# Altium schematic sheet imx477_sensor.SchDoc
size A3
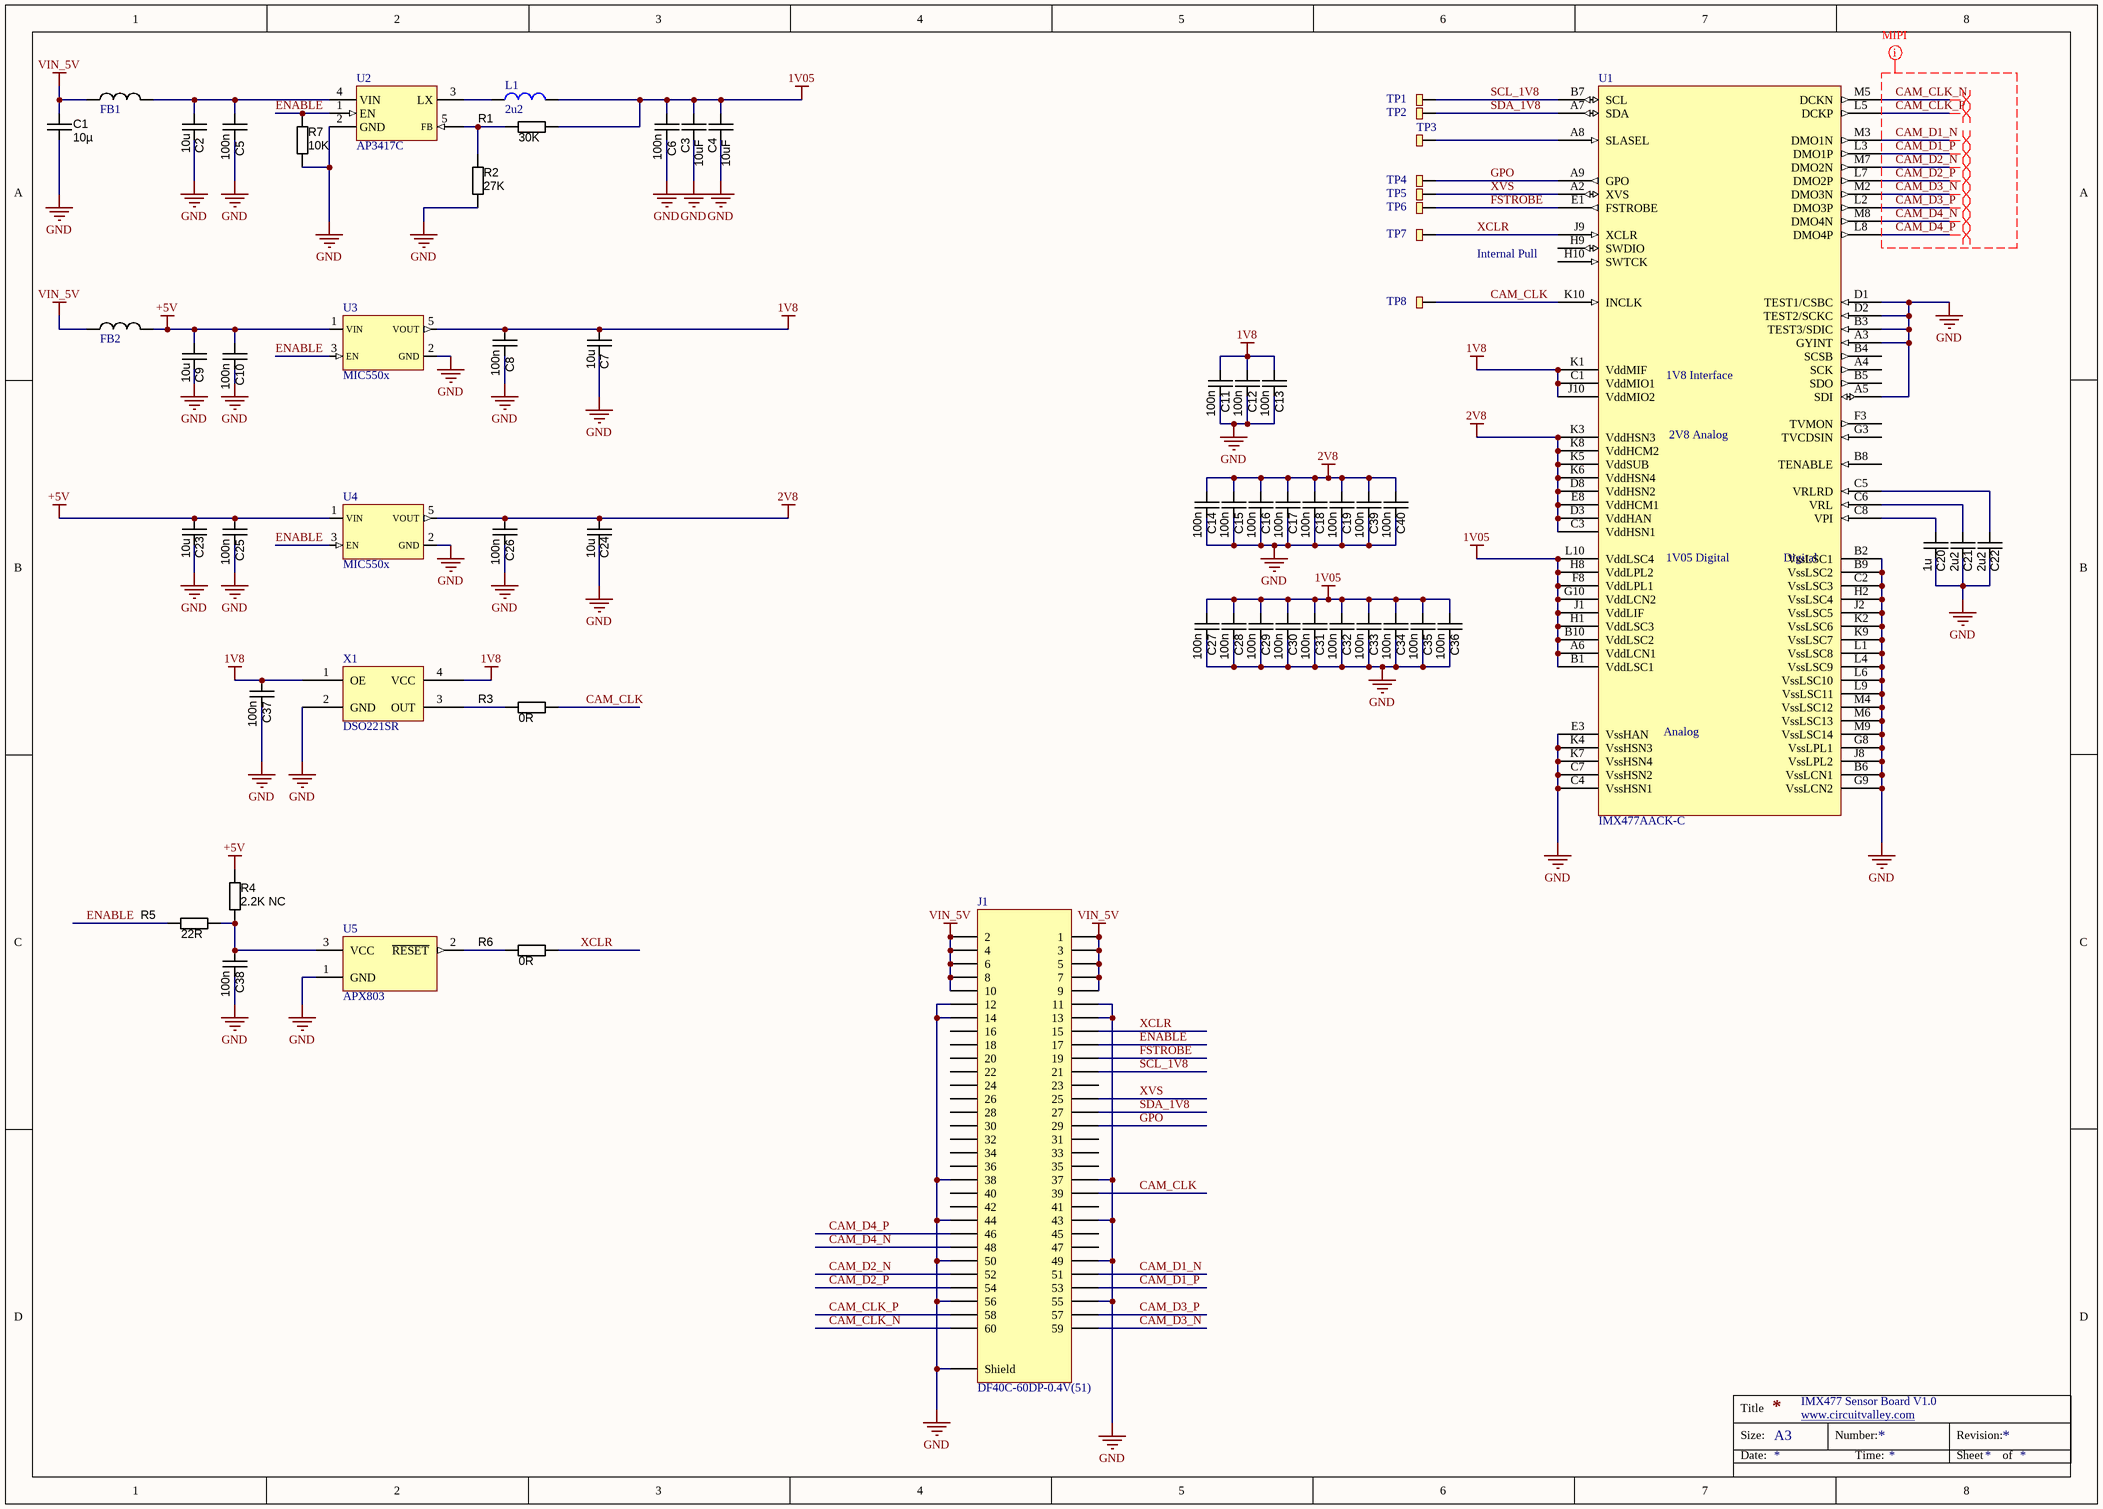
[diagram p0: imx477_sensor.SchDoc]

## Parts
C1  10µ  [CAPC3225N]
C2  value 10u  [CAPC1608N]  (hidden comment: approved sub OK)
C3  10uF  [CAPC2012N]
C4  10uF  [CAPC2012N]
C5  100n  [CAPC1005N]
C6  100n  [CAPC1005N]
C7  value 10u  [CAPC1608N]  (hidden comment: approved sub OK)
C8  100n  [CAPC1005N]
C9  value 10u  [CAPC1608N]  (hidden comment: approved sub OK)
C10  100n  [CAPC1005N]
C11  100n  [CAPC1005N]
C12  100n  [CAPC1005N]
C13  100n  [CAPC1005N]
C14  100n  [CAPC1005N]
C15  100n  [CAPC1005N]
C16  100n  [CAPC1005N]
C17  100n  [CAPC1005N]
C18  100n  [CAPC1005N]
C19  100n  [CAPC1005N]
C20  value 1u  [CAPC1608N]  (hidden comment: approved sub OK)
C21  value 2u2  [CAPC1608N]  (hidden comment: approved sub OK)
C22  value 2u2  [CAPC1608N]  (hidden comment: approved sub OK)
C23  value 10u  [CAPC1608N]  (hidden comment: approved sub OK)
C24  value 10u  [CAPC1608N]  (hidden comment: approved sub OK)
C25  100n  [CAPC1005N]
C26  100n  [CAPC1005N]
C27  100n  [CAPC1005N]
C28  100n  [CAPC1005N]
C29  100n  [CAPC1005N]
C30  100n  [CAPC1005N]
C31  100n  [CAPC1005N]
C32  100n  [CAPC1005N]
C33  100n  [CAPC1005N]
C34  100n  [CAPC1005N]
C35  100n  [CAPC1005N]
C36  100n  [CAPC1005N]
C37  100n  [CAPC1005N]
C38  100n  [CAPC1005N]
C39  100n  [CAPC1005N]
C40  100n  [CAPC1005N]
FB1  Ferrite  [INDC1608N]  (value not drawn)
FB2  Ferrite  [INDC1608N]  (value not drawn)
J1  DF40C-60DP-0.4V(51)  [DF40C-60DP-0.4V]
L1  2u2  [FDSD0420-H-2R2M]
R1  value 30K  [RESC1005N]  (hidden comment: Thick Film)
R2  value 27K  [RESC1005N]  (hidden comment: Thick Film)
R3  value 0R  [RESC1005N]  (hidden comment: Thick Film)
R4  value 2.2K NC  [RESC1005N]  (hidden comment: Thick Film)
R5  value 22R  [RESC1005N]  (hidden comment: Thick Film)
R6  value 0R  [RESC1005N]  (hidden comment: Thick Film)
R7  value 10K  [RESC1005N]  (hidden comment: Thick Film)
TP1  TestPoint  [SMD_test_point]  (value not drawn)
TP2  TestPoint  [SMD_test_point]  (value not drawn)
TP3  TestPoint  [SMD_test_point]  (value not drawn)
TP4  TestPoint  [SMD_test_point]  (value not drawn)
TP5  TestPoint  [SMD_test_point]  (value not drawn)
TP6  TestPoint  [SMD_test_point]  (value not drawn)
TP7  TestPoint  [SMD_test_point]  (value not drawn)
TP8  TestPoint  [SMD_test_point]  (value not drawn)
U1  IMX477AACK-C  [IMX477]
U2  AP3417C  [SOT23-5]
U3  MIC550x  [SOT23-5]
U4  MIC550x  [SOT23-5]
U5  APX803  [SOT23-3]
X1  DSO221SR  [Active Oscillator 2520]

## Nets
1V05: C3.1 C4.1 C6.2 C27.2 C28.2 C29.2 C30.2 C31.2 C32.2 C33.2 C34.2 C35.2 C36.2 L1.2 R1.2 U1.A6(VddLCN1) U1.B1(VddLSC1) U1.B10(VddLSC2) U1.F8(VddLPL1) U1.G10(VddLCN2) U1.H1(VddLSC3) U1.H8(VddLPL2) U1.J1(VddLIF) U1.L10(VddLSC4)
1V8: C7.1 C8.2 C11.2 C12.2 C13.2 C37.2 U1.C1(VddMIO1) U1.J10(VddMIO2) U1.K1(VddMIF) U3.5(VOUT) X1.1(OE) X1.4(VCC)
2V8: C14.2 C15.2 C16.2 C17.2 C18.2 C19.2 C24.1 C26.2 C39.2 C40.2 U1.C3(VddHSN1) U1.D3(VddHAN) U1.D8(VddHSN2) U1.E8(VddHCM1) U1.K3(VddHSN3) U1.K5(VddSUB) U1.K6(VddHSN4) U1.K8(VddHCM2) U4.5(VOUT)
+5V: C9.1 C10.2 C23.1 C25.2 FB2.2 R4.2 U3.1(VIN) U4.1(VIN)
GND: C1.2 C2.2 C3.2 C4.2 C5.1 C6.1 C7.2 C8.1 C9.2 C10.1 C11.1 C12.1 C13.1 C14.1 C15.1 C16.1 C17.1 C18.1 C19.1 C20.2 C21.2 C22.2 C23.2 C24.2 C25.1 C26.1 C27.1 C28.1 C29.1 C30.1 C31.1 C32.1 C33.1 C34.1 C35.1 C36.1 C37.1 C38.1 C39.1 C40.1 J1.11 J1.12 J1.13 J1.14 J1.37 J1.38 J1.43 J1.44 J1.49 J1.50 J1.55 J1.56 J1.S1(Shield) R2.1 R7.1 U1.A3(GYINT) U1.A5(SDI) U1.B2(VssLSC1) U1.B3(TEST3/SDIC) U1.B6(VssLCN1) U1.B9(VssLSC2) U1.C2(VssLSC3) U1.C4(VssHSN1) U1.C7(VssHSN2) U1.D1(TEST1/CSBC) U1.D2(TEST2/SCKC) U1.E3(VssHAN) U1.G8(VssLPL1) U1.G9(VssLCN2) U1.H2(VssLSC4) U1.J2(VssLSC5) U1.J8(VssLPL2) U1.K2(VssLSC6) U1.K4(VssHSN3) U1.K7(VssHSN4) U1.K9(VssLSC7) U1.L1(VssLSC8) U1.L4(VssLSC9) U1.L6(VssLSC10) U1.L9(VssLSC11) U1.M4(VssLSC12) U1.M6(VssLSC13) U1.M9(VssLSC14) U2.2(GND) U3.2(GND) U4.2(GND) U5.1(GND) X1.2(GND)
VIN_5V: C1.1 FB1.1 FB2.1 J1.1 J1.2 J1.3 J1.4 J1.5 J1.6 J1.7 J1.8 J1.9 J1.10
CAM_CLK: J1.39 R3.2 TP8.1(TP) U1.K10(INCLK)
CAM_CLK_N: J1.60 U1.M5(DCKN)
CAM_CLK_P: J1.58 U1.L5(DCKP)
CAM_D1_N: J1.51 U1.M3(DMO1N)
CAM_D1_P: J1.53 U1.L3(DMO1P)
CAM_D2_N: J1.52 U1.M7(DMO2N)
CAM_D2_P: J1.54 U1.L7(DMO2P)
CAM_D3_N: J1.59 U1.M2(DMO3N)
CAM_D3_P: J1.57 U1.L2(DMO3P)
CAM_D4_N: J1.48 U1.M8(DMO4N)
CAM_D4_P: J1.46 U1.L8(DMO4P)
ENABLE: J1.17 R5.1 R7.2 U2.1(EN) U3.3(EN) U4.3(EN)
FSTROBE: J1.19 TP6.1(TP) U1.E1(FSTROBE)
GPO: J1.29 TP4.1(TP) U1.A9(GPO)
SCL_1V8: J1.21 TP1.1(TP) U1.B7(SCL)
SDA_1V8: J1.27 TP2.1(TP) U1.A7(SDA)
XCLR: J1.15 R6.2 TP7.1(TP) U1.J9(XCLR)
XVS: J1.25 TP5.1(TP) U1.A2(XVS)
NetC2_1: C2.1 C5.2 FB1.2 U2.4(VIN)
NetC20_1: C20.1 U1.C8(VPI)
NetC21_1: C21.1 U1.C6(VRL)
NetC22_1: C22.1 U1.C5(VRLRD)
NetC38_2: C38.2 R4.1 R5.2 U5.3(VCC)
NetL1_1: L1.1 U2.3(LX)
NetR1_1: R1.1 R2.2 U2.5(FB)
NetR3_1: R3.1 X1.3(OUT)
NetR6_1: R6.1 U5.2(~{RESET})
NetTP3_1: TP3.1(TP) U1.A8(SLASEL)

Not connected (* = marked no-connect by the designer): J1 16 18 20 22 23 24 26 28 30 31 32 33 34 35 36 40 41 42 45 47; U1 A4(SCK) B4(SCSB) B5(SDO) B8(TENABLE) F3(TVMON) G3(TVCDSIN) H9(SWDIO) H10(SWTCK)

## Layout directives
net class MIPI: CAM_CLK_N, CAM_CLK_P, CAM_D1_N, CAM_D1_P, CAM_D2_N, CAM_D2_P, CAM_D3_N, CAM_D3_P, CAM_D4_N, CAM_D4_P
differential pair: CAM_CLK_N, CAM_CLK_P, CAM_D1_N, CAM_D1_P, CAM_D2_N, CAM_D2_P, CAM_D3_N, CAM_D3_P, CAM_D4_N, CAM_D4_P

## Notes on the sheet
- Internal Pull
- IMX477 Sensor Board V1.0
- www.circuitvalley.com <http://www.circuitvalley.com>
- Title
- Size:
- Date:
- A3
- Number:
- Time:
- Revision:
- Sheet
- of
- (in symbol IMX477AACK-C) 1V8 Interface; 2V8 Analog; 1V05 Digital; Digital; Analog

## Library data of the parts
C1 = CAPC_10u_1210_50V: Capacitor SMD Cer 10uF 20% 16V X5R 1210; Manufacturer 1: Taiyo Yuden; Manufacturer Part Number 1: UMK325BJ106MM-T; Ratings: 50V; X5R; Material: ceramic; Package / Case: 1210 (3225 Metric); Tolerance: ±20%; Size / Dimension: 0.126" L x 0.098" W (3.20mm x 2.50mm); Supplier 1: Digi-Key; Supplier Part Number 1: 587-2225-1-ND; Value: 10µ
C2 C7 C9 C20-C24 = CAPC_560p_0603_5%: Capacitor SMD Cer 560pF 5% 50V NP0 0603; Manufacturer 1: AVX Corporation; Manufacturer Part Number 1: 06035A561JAT2A; Ratings: 50V; NP0; Material: ceramic; Capacitance: 470pF; Package / Case: 0603 (1608 metric); Voltage - Rated: 50V; Mounting Type: Surface Mount, MLCC; Operating Temperature: -55°C ~ 125°C; Applications: General Purpose; Size / Dimension: 0.063" L x 0.032" W (1.60mm x 0.81mm); Height - Seated (Max): -; Thickness (Max): 0.035" (0.90mm); Lead Spacing: -; Lead Style: -; ComponentLink1URL: http://www.avx.com/docs/Catalogs/ccog.pdf; ComponentLink1Description: http://www.avx.com/docs/Catalogs/ccog.pdf; Supplier 1: Digi-Key; Supplier Part Number 1: 478-1184-1-ND
C3 C4 = CAPC_4u7_0805: Capacitor SMD Cer 4.7uF 10% 16V X5R 0805; Manufacturer 1: Taiyo Yuden; Manufacturer Part Number 1: EMK212BJ475KG-T; Ratings: 16V; X5R; Material: ceramic; Package / Case: 0805 (2012 Metric); Tolerance: ±10%; Supplier 1: Digi-Key; Supplier Part Number 1: 587-1294-1-ND; Operating Temperature: -55°C ~ 85°C; Size / Dimension: 0.079" L x 0.049" W (2.00mm x 1.25mm); Thickness (Max): 0.053" (1.35mm); ComponentLink1URL: http://www.yuden.co.jp/productdata/catalog/en/mlcc01_e.pdf; ComponentLink1Description: http://www.yuden.co.jp/productdata/catalog/en/mlcc01_e.pdf; Value: 10uF
C5 C6 C8 C10-C19 C25-C40 = CAPC_10n_0402_16V_10%: Capacitor SMD Cer 10nF 10% 16V X7R 0402; Manufacturer 1: AVX Corporation; Manufacturer Part Number 1: 0402YC103KAT2A; Ratings: 16V; X7R; Tolerance: ±10%; Operating Temperature: -55°C ~ 125°C; Package / Case: 0402 (1005 Metric); Size / Dimension: 0.039" L x 0.020" W (1.00mm x 0.50mm); Manufacturer 2: Yageo; Manufacturer Part Number 2: CC0402KRX7R7BB103; Supplier 1: Digi-Key; Supplier Part Number 1: 478-1114-1-ND; ComponentLink1URL: http://www.avx.com/docs/Catalogs/cx7r.pdf; ComponentLink1Description: http://www.avx.com/docs/Catalogs/cx7r.pdf; Supplier 2: Digi-Key; Supplier Part Number 2: 311-1042-1-ND; ComponentLink2URL: http://www.yageo.com/documents/recent/UPY-GPHC_X7R_6.3V-to-50V_8.pdf; ComponentLink2Description: http://www.yageo.com/documents/recent/UPY-GPHC_X7R_6.3V-to-50V_8.pdf; Value: 100n
J1 = LSHM-130-xx: Samtec 0.5mm 60 pin Connector
L1 = inductor_smd
R1-R7 = RES_3K3_0402_5%: Resistor SMD chip 3.3k Ohm 0.063W 5% 0402; Manufacturer 1: Yageo; Manufacturer Part Number 1: RC0402JR-073K3L; Ratings: 1/16 W; Package / Case: 0402 (1005 metric); Tolerance: ±5%; Material: Thick Film; Supplier 1: Digi-Key; Supplier Part Number 1: 311-3.3KJRCT-ND; ComponentLink1URL: http://www.yageo.com/documents/recent/PYu-RC0402_51_RoHS_L_6.pdf; ComponentLink1Description: http://www.yageo.com/documents/recent/PYu-RC0402_51_RoHS_L_6.pdf
TP1-TP8 = SMD_Test_Point: SMD Test Point
U1 = IMX477AACK-C: Sony Color Image Sensor
X1 = Oscillator_2520: Active Oscillator_2520